# EAGLE design Tempy (EAGLE 7.7.0)
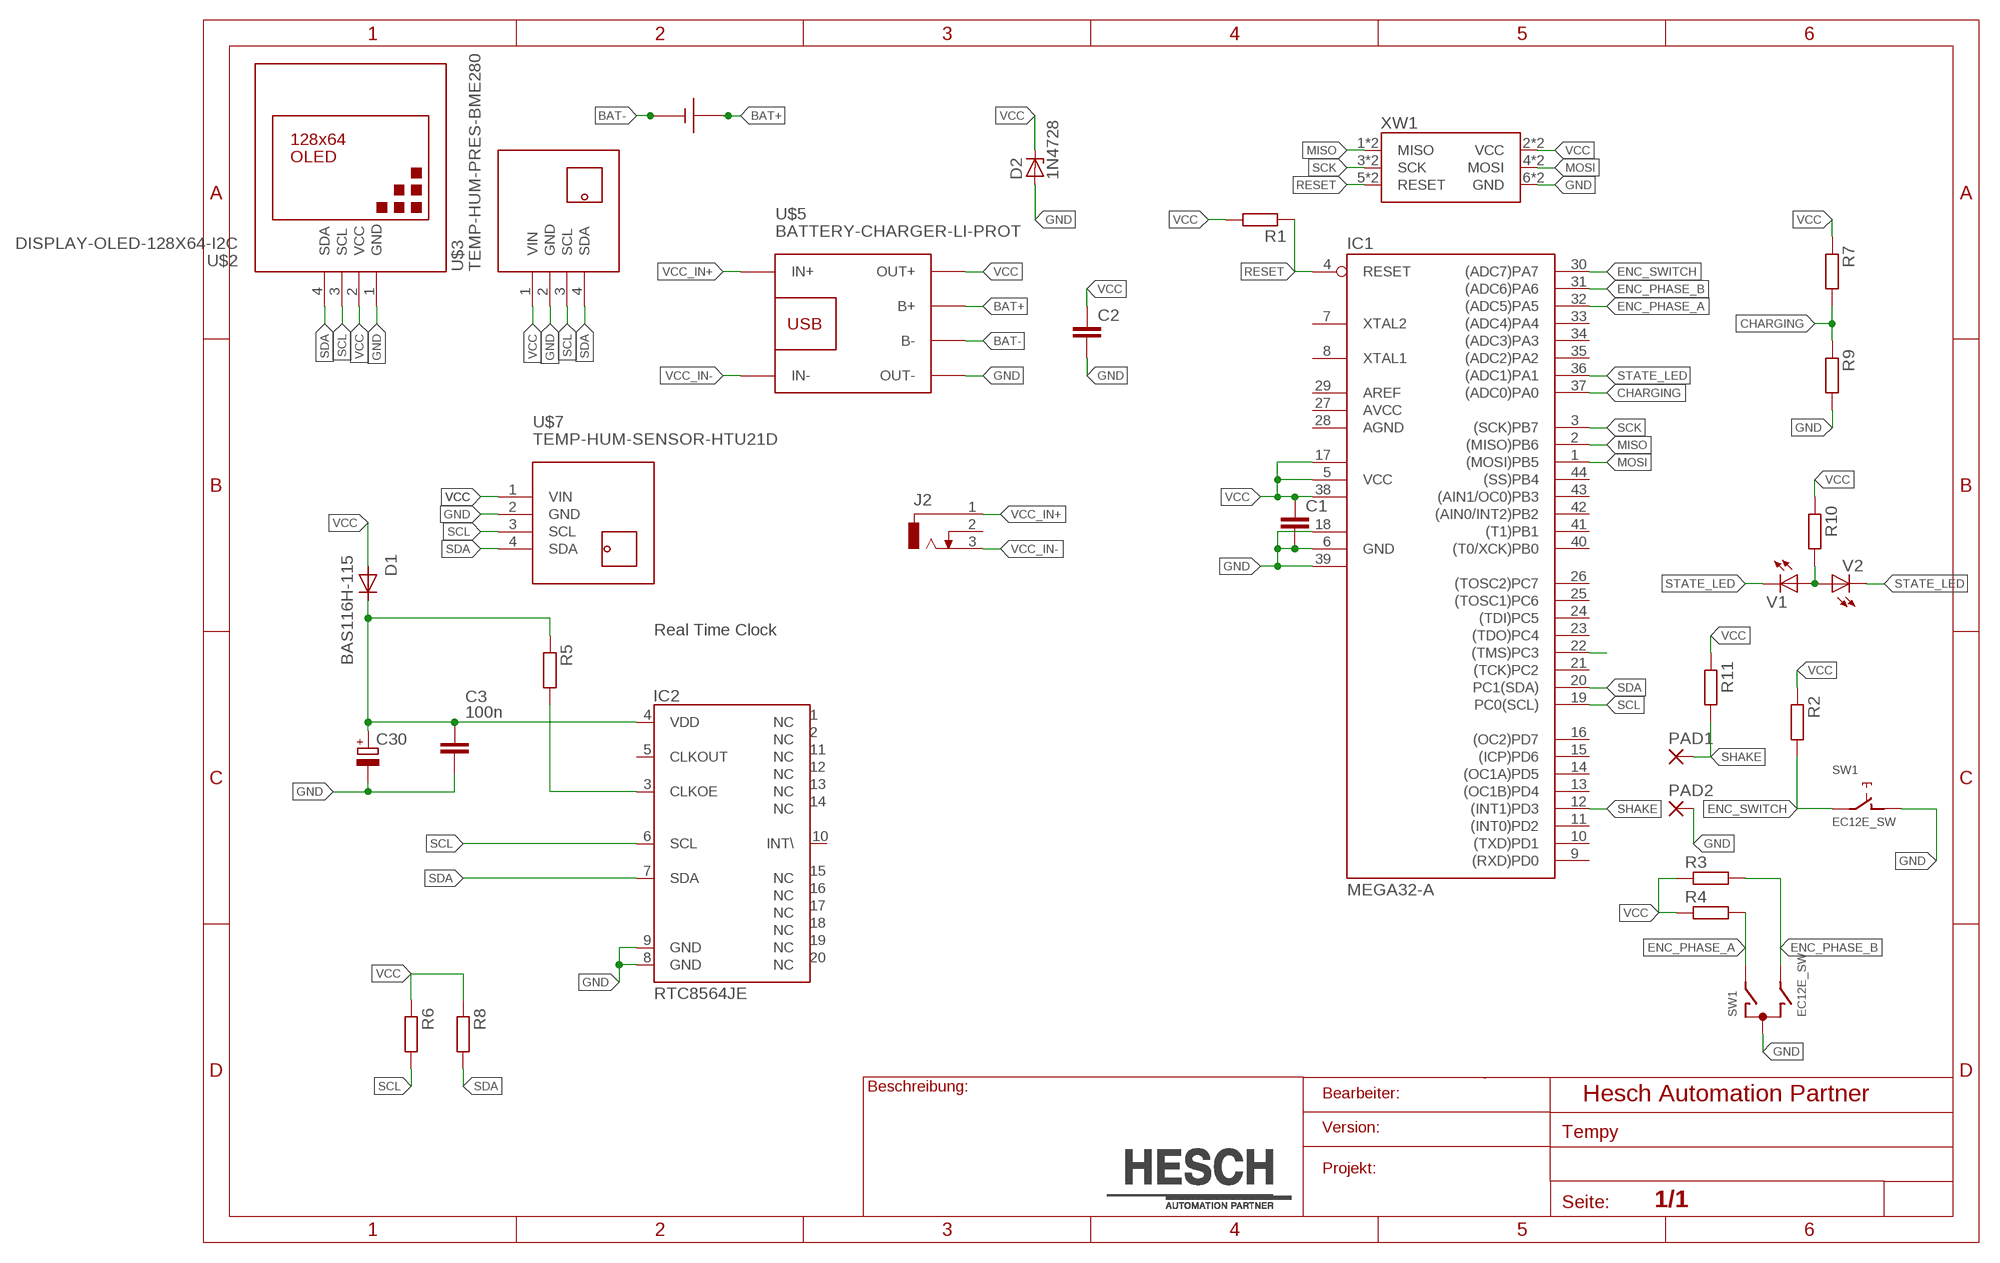
[diagram p0: schematic, sheet 1]

## Parts
C1  C-EUC0805K  [C0805K]
C2  C-EUC0805K  [C0805K]
C3  100n  C-EUC0805  [C0805]
C30  PANASONIC-EN&SD-SERIESTHT_1  [PANASONIC_SD_SERIES_STEHEND]
D1  BAS116H-115  [SOD123]
D2  1N4728  [DO41Z10]
IC1  MEGA32-A  [TQFP44]
IC2  RTC8564JESMD  [VSOJ20]
J2  DCJ0303  [DCJ0303]
PAD1  2,15/1,0  [2,15/1,0]
PAD2  2,15/1,0  [2,15/1,0]
R1  R-EU_R1206  [R1206]
R2  R-EU_R1206  [R1206]
R3  R-EU_R1206  [R1206]
R4  R-EU_R1206  [R1206]
R5  R-EU_R1206  [R1206]
R6  R-EU_R1206  [R1206]
R7  R-EU_R1206  [R1206]
R8  R-EU_R1206  [R1206]
R9  R-EU_R1206  [R1206]
R10  R-EU_R1206  [R1206]
R11  R-EU_R1206  [R1206]
SW1  EC12E_SW  [ALPS_EC12E_SW]
U$2  DISPLAY-OLED-128X64-I2C  [DISPLAY-OLED-128X64-I2C]
U$3  TEMP-HUM-PRES-BME280  [TEMP-HUM-PRES-BME280]
U$5  BATTERY-CHARGER-LI-PROT  [BATTERY-CHARGER-LI-PROT]
U$7  TEMP-HUM-SENSOR-HTU21D  [TEMP-HUM-SENSOR-HTU21D]
U$8  18650PTH  [18650-CASE-PTH]
V1  0805SMD  [0805]
V2  1206SMD  [1206]
XW1  WSL  [WSL_KOMBI]

## Nets
BAT+: U$5.B+ U$8.POS
BAT-: U$5.B- U$8.NEG
CHARGING: IC1.37((ADC0)PA0) R7.2 R9.1
ENC_PHASE_A: IC1.32((ADC5)PA5) R4.2 SW1.A
ENC_PHASE_B: IC1.31((ADC6)PA6) R3.2 SW1.B
ENC_SWITCH: IC1.30((ADC7)PA7) R2.2 SW1.E
GND: C1.2 C2.2 C3.2 C30.- D2.A IC1.6(GND) IC1.18(GND1) IC1.39(GND2) IC2.8(GND) IC2.9(GND) PAD2.1(P) R9.2 SW1.C SW1.D U$2.1(GND) U$3.2(GND) U$5.OUT- U$7.2(GND) XW1.6(GND) XW1.6.1(GND)
MISO: IC1.2((MISO)PB6) XW1.1(MISO) XW1.1.1(MISO)
MOSI: IC1.1((MOSI)PB5) XW1.4(MOSI) XW1.4.1(MOSI)
N$4: IC1.22((TMS)PC3)
N$6: R10.2 V1.A V2.A
N$12: IC2.3(CLKOE) R5.2
RESET: IC1.4(RESET) R1.1 XW1.5(RESET) XW1.5.1(RESET)
SCK: IC1.3((SCK)PB7) XW1.3(SCK) XW1.3.1(SCK)
SCL: IC1.19(PC0(SCL)) IC2.6(SCL) R6.2 U$2.3(SCL) U$3.3(SCL) U$7.3(SCL)
SDA: IC1.20(PC1(SDA)) IC2.7(SDA) R8.2 U$2.4(SDA) U$3.4(SDA) U$7.4(SDA)
SHAKE: IC1.12((INT1)PD3) PAD1.1(P) R11.2
STATE_LED: IC1.36((ADC1)PA1) V1.K V2.K
SUPPLY_RTC: C3.1 C30.+ D1.C IC2.4(VDD) R5.1
VCC: C1.1 C2.1 D1.A D2.C IC1.5(VCC) IC1.17(VCC1) IC1.38(VCC2) R1.2 R2.1 R3.1 R4.1 R6.1 R7.1 R8.1 R10.1 R11.1 U$2.2(VCC) U$3.1(VIN) U$5.OUT+ U$7.1(VIN) XW1.2(VCC) XW1.2.1(VCC)
VCC_IN+: J2.1 U$5.IN+
VCC_IN-: J2.3 U$5.IN-
Unconnected: IC1.7(XTAL2) IC1.8(XTAL1) IC1.9((RXD)PD0) IC1.10((TXD)PD1) IC1.11((INT0)PD2) IC1.13((OC1B)PD4) IC1.14((OC1A)PD5) IC1.15((ICP)PD6) IC1.16((OC2)PD7) IC1.21((TCK)PC2) IC1.23((TDO)PC4) IC1.24((TDI)PC5) IC1.25((TOSC1)PC6) IC1.26((TOSC2)PC7) IC1.33((ADC4)PA4) IC1.34((ADC3)PA3) IC1.35((ADC2)PA2) IC1.40((T0/XCK)PB0) IC1.41((T1)PB1) IC1.42((AIN0/INT2)PB2) IC1.43((AIN1/OC0)PB3) IC1.44((SS)PB4) IC2.1(NC) IC2.2(NC) IC2.5(CLKOUT) IC2.10(INT\) IC2.11(NC) IC2.12(NC) IC2.13(NC) IC2.14(NC) IC2.15(NC) IC2.16(NC) IC2.17(NC) IC2.18(NC) IC2.19(NC) IC2.20(NC) J2.2 SW1.GND1(G) SW1.GND2(G)

## Notes on the sheet
- Real Time Clock

## Power pins joined to a net without a drawn wire
AGND: IC1.28(AGND)
AREF: IC1.29(AREF)
AVCC: IC1.27(AVCC)

## Library data of the parts
C1-C3 = rcl:C-EU: CAPACITOR, European symbol
C30 = Kondensator - GoldCaps:PANASONIC-EN&SD-SERIES: Name des Bauteiles: -->Doppelschicht Kondensator Daten:radial (stehend), 70°C, 5,5V Artikelnummer:#014000 Datenblatt:www.alldatasheet.com __________________________________________ generated by Eagle Description Tool am : 23.01.2014 13:04:36 erstellt von: Hm
D1 = Dioden:BAS116H: Name des Bauteiles: -->BAS116H Daten:BAS116H Ultra Low Leakage Diode speziell für die energiesparende Verbindung von Goldcaps mit Echtzeituhren, extrem kleiner Leckstrom Artikelnummer:#105016 Datenblatt:www.alldatasheet.com __________________________________________ generated by Eagle Description Tool am : 29.01.2014 07:16:55 erstellt von: Hm
D2 = diode:1N4728: Z DIODE 3.3 V, 1W, 5 percent
IC1 = Atmel - µController:MEGA32: MICROCONTROLLER 32 Kbytes FLASH 2 Kbytes SRAM 1 Kbytes EEPROM USART 8-channel 10 bit ADC
IC2 = Echtzeituhr - RTC8564JE:RTC8564JE: Name des Bauteiles: -->RTC8564JE Daten:Bauform : VSO120 Artikelnummer:#045172 Datenblatt:www.alldatasheet.com __________________________________________ generated by Eagle Description Tool am : 23.01.2014 10:55:17 erstellt von: Hm
J2 = con-jack:DCJ0303: DC POWER JACK Source: DCJ0303.pdf; OC_FARNELL: unknown; OC_NEWARK: unknown
PAD1 PAD2 = wirepad:2,15/1,0: THROUGH-HOLE PAD
R1-R11 = rcl:R-EU_: RESISTOR, European symbol
SW1 = switch-alps:EC12E_SW: ALPS rotary Encoder EC12E series with switch; MPN: EC12E2424407; OC_FARNELL: 1520813; OC_NEWARK: 74M1068
U$2 = diy-modules:DISPLAY-OLED-128X64-I2C: 128x64 Dot Matrix OLED Module based on SSD1306 chip Variant with I2C interface More details available here: http://www.instructables.com/id/Monochrome-096-i2c-OLED-display-with-arduino-SSD13/ SSD1306 datasheet: https://cdn-shop.adafruit.com/datasheets/SSD1306.pdf Click here to find device on ebay.com <http://www.ebay.com/sch/oled+display+128x64+iic> Note: There are two variants: I2C and SPI. Search for the proper version.
U$3 = diy-modules:TEMP-HUM-PRES-BME280: Digital Humidity-Temperature-Pressure Sensor based on BME280 device More information about BME280 device is available here: https://www.bosch-sensortec.com/bst/products/all_products/bme280 Click here to find device on ebay.com <http://www.ebay.com/sch/bme280+breakout>
U$5 = diy-modules:BATTERY-CHARGER-LI-PROT: Lithium Battery 5V Charger with protection circuit More details available here: http://www.instructables.com/id/DIY-Lithium-ion-Battery-Charger/step4/TP4056-based-lithium-ion-battery-charger-module/ Click here to find device on ebay.com <http://www.ebay.com/sch/tp4056+charger+usb+protection>
U$7 = diy-modules:TEMP-HUM-SENSOR-HTU21D: Digital Humidity & Temperature Sensor based on HTU21D device More information about HTU21D device is available here: http://futureeverything.org/wp-content/uploads/2014/05/Humidity-Datasheet.pdf HTU21D Arudino Library is available here: https://learn.sparkfun.com/tutorials/htu21d-humidity-sensor-hookup-guide/htu21d-library-and-functions Click here to find device on ebay.com <http://www.ebay.com/sch/htu21d+board>
U$8 = Batteriehalter - 18650:18650: Lithium Ion 18650
V1 = LED´s:0805
V2 = LED´s:1206
XW1 = Atmel - ISP_6   (AVR ISP MKII):WSL: Name des Bauteiles: Wannenstecker 6 pol. Daten: 6 pol. goldene Kontakte ! Artikelnummer:#131231 Datenblatt:www.datasheet.com / www.reichelt.de

## Board
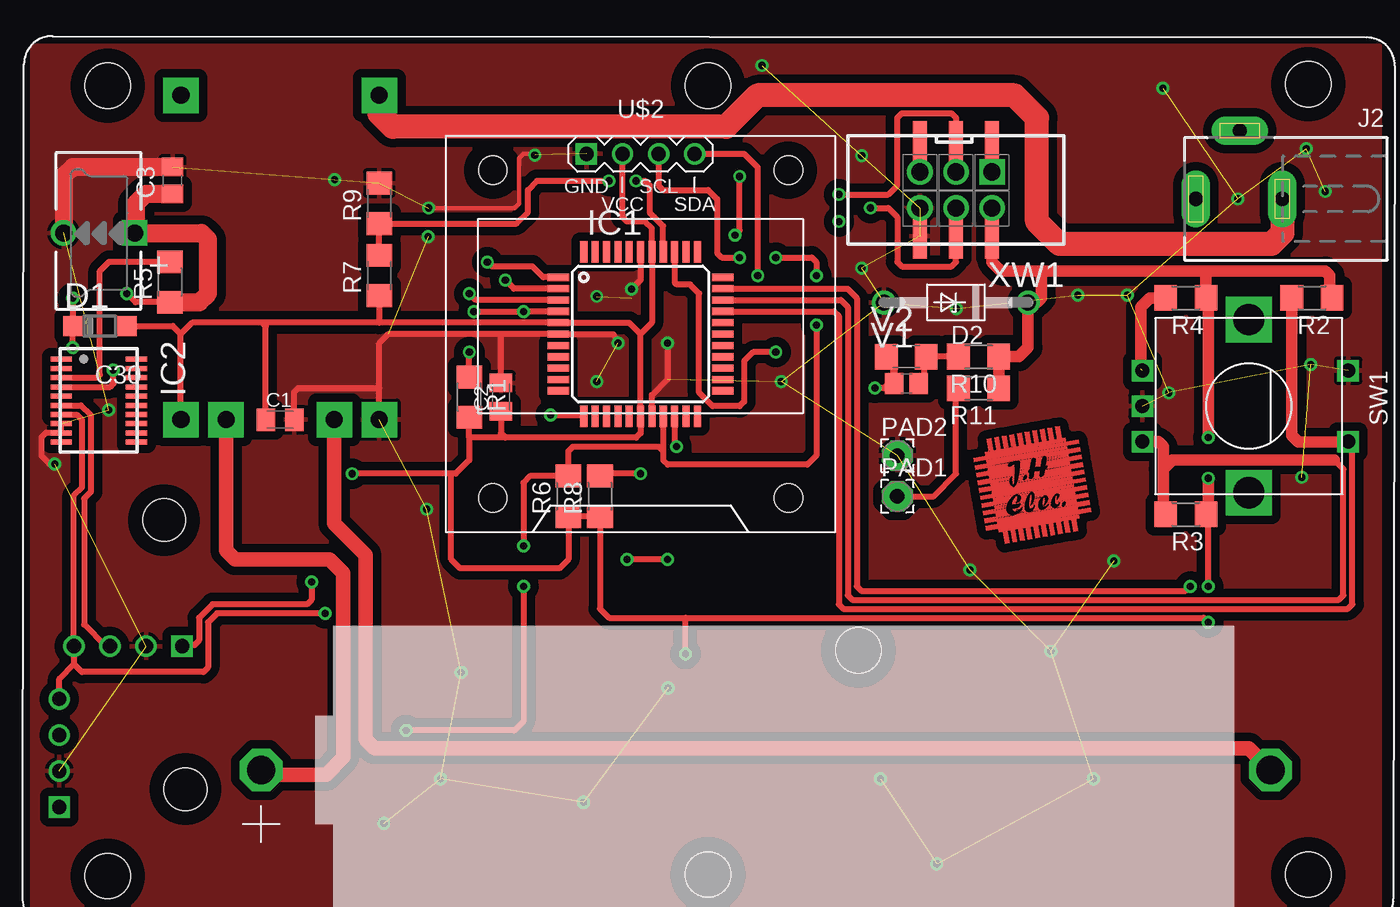
[diagram p1: board, top side]
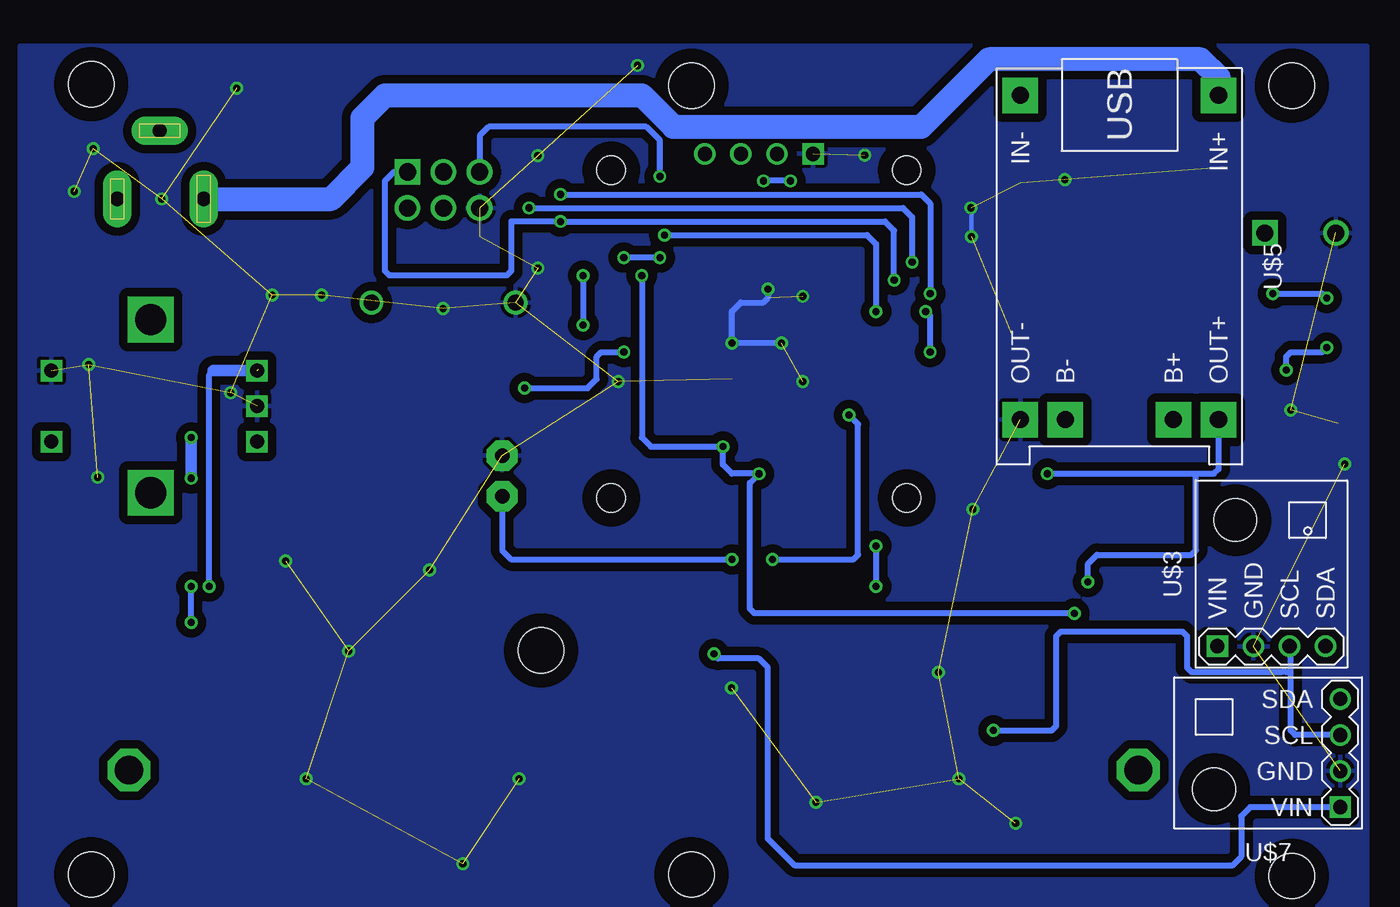
[diagram p2: board, bottom side, seen from below]

No outline drawn. Coordinates in mm, seen from the top.
Copper layers (1*16): Top 0.035mm / dielectric 1.5mm / Bottom 0.035mm
Design rules "default": minimum track width 10mil, minimum drill 24mil, track to track 8mil, track to pad 8mil, pad to pad 8mil, via to via 8mil, smd to smd 8mil, copper to edge 40mil, drill to drill 8mil, minimum pad ring 10mil, minimum via ring 8mil, stop-mask expansion 4mil, vias tented up to drill 0mil, thermal gap 10mil

### Footprints (pad centres in the part's own frame; a part is rotated, then mirrored left to right if it is on the bottom)
C0805K = smd 1.3 x 1.6: 1 -1,0; 2 1,0
C0805 = smd 1.3 x 1.5: 1 -0.95,0; 2 0.95,0
PANASONIC_SD_SERIES_STEHEND = drill 1.2 square: + -2.54,-6.35 | drill 1.2: - 2.46,-6.35
SOD123 = smd 1.4 x 1.4: A 1.9,0; C -1.9,0
DO41Z10 = drill 1.118: A 5.08,0; C -5.08,0
TQFP44 = smd 1.5 x 0.5: 1 -5.8,4; 2 -5.8,3.2; 3 -5.8,2.4; 4 -5.8,1.6; 5 -5.8,0.8; 6 -5.8,0; 7 -5.8,-0.8; 8 -5.8,-1.6; 9 -5.8,-2.4; 10 -5.8,-3.2; 11 -5.8,-4; 23 5.8,-4; 24 5.8,-3.2; 25 5.8,-2.4; 26 5.8,-1.6; 27 5.8,-0.8; 28 5.8,0; 29 5.8,0.8; 30 5.8,1.6; 31 5.8,2.4; 32 5.8,3.2; 33 5.8,4 | smd 0.5 x 1.5: 12 -4,-5.8; 13 -3.2,-5.8; 14 -2.4,-5.8; 15 -1.6,-5.8; 16 -0.8,-5.8; 17 0,-5.8; 18 0.8,-5.8; 19 1.6,-5.8; 20 2.4,-5.8; 21 3.2,-5.8; 22 4,-5.8; 34 4,5.8; 35 3.2,5.8; 36 2.4,5.8; 37 1.6,5.8; 38 0.8,5.8; 39 0,5.8; 40 -0.8,5.8; 41 -1.6,5.8; 42 -2.4,5.8; 43 -3.2,5.8; 44 -4,5.8
VSOJ20 = smd 0.35 x 1.5: 1 0,0; 2 0.65,0; 3 1.3,0; 4 1.95,0; 5 2.6,0; 6 3.25,0; 7 3.9,0; 8 4.55,0; 9 5.2,0; 10 5.85,0; 11 5.85,5.3; 12 5.2,5.3; 13 4.55,5.3; 14 3.9,5.3; 15 3.25,5.3; 16 2.6,5.3; 17 1.95,5.3; 18 1.3,5.3; 19 0.65,5.3; 20 0,5.3
DCJ0303 = drill 1 pad 2 long: 1 0,3.1; 2 4.8,0; 3 0,-3
2,15/1,0 = drill 1.016 pad 2.159 octagon: 1 0,0
R1206 = smd 1.6 x 1.803: 1 -1.422,0; 2 1.422,0
ALPS_EC12E_SW = drill 1 square: A -2.5,-7.5; B 2.5,-7.5; C 0,-7.5; D -2.5,7; E 2.5,7 | drill 2.2 square: GND1 -6.1,0; GND2 6.1,0
DISPLAY-OLED-128X64-I2C = drill 1 square: 1 -3.81,12.7 | drill 1: 2 -1.27,12.7; 3 1.27,12.7; 4 3.81,12.7 | hole 2: -10.414,11.557; 10.414,11.557; 10.414,-11.557; -10.414,-11.557
TEMP-HUM-PRES-BME280 = drill 1 square: 1 -5.08,3.81 | drill 1: 2 -5.08,1.27; 3 -5.08,-1.27; 4 -5.08,-3.81 | hole 3: 3.81,2.54
DONAU_KGB10 = hole 3.2: 0,0; 42.3,0; -42.3,-0.1; -42.3,55.6; 0,55.6; 42.3,55.7; 10.6,15.8
BATTERY-CHARGER-LI-PROT = drill 1.2 pad 2.5 square: B+ 10.795,3.81; B- 10.795,-3.81; IN+ -12.065,6.985; IN- -12.065,-6.985; OUT+ 10.795,6.985; OUT- 10.795,-6.985
TEMP-HUM-SENSOR-HTU21D = drill 1 square: 1 -5.08,3.81 | drill 1: 2 -5.08,1.27; 3 -5.08,-1.27; 4 -5.08,-3.81 | hole 3: 3.81,2.54
18650-CASE-PTH = drill 2 octagon: NEG -35.56,0; POS 35.56,0
0805 = smd 1.3 x 1.5: A 0.85,0; K -0.85,0
1206 = smd 1.6 x 1.8: A 1.4,0; K -1.4,0
WSL_KOMBI = drill 1.2 square: 1 -2.54,-1.27 | smd 1 x 3.2: 1.1 -2.54,-3.24; 2.1 -2.54,3.24; 3.1 0,-3.24; 4.1 0,3.24; 5.1 2.54,-3.24; 6.1 2.54,3.24 | drill 1.2: 2 -2.54,1.27; 3 0,-1.27; 4 0,1.27; 5 2.54,-1.27; 6 2.54,1.27

### Placement (x,y rotation side)
C1  19.68,67.31 0 top
C2  35.24,68.9 90 top
C3  12.11,84.17 90 top
C30  6.89,74.12 180 top
D1  7,73.91 0 top
D2  67.31,75.56 180 top
IC1  45.09,73.34 0 top
IC2  4.26,71.57 270 top
J2  87.31,82.87 90 top
PAD1  63.18,61.91 0 top
PAD2  63.18,64.77 0 top
R1  33.02,68.9 270 top
R2  92.39,75.88 180 top
R3  83.5,60.64 180 top
R4  83.5,75.88 180 top
R5  11.93,77.01 90 top
R6  40.01,61.91 90 top
R7  26.67,77.47 90 top
R8  42.23,61.91 90 top
R9  26.67,82.55 90 top
R10  68.9,71.75 180 top
R11  68.9,69.53 180 top
SW1  87.95,68.26 270 top
U$2  45.09,73.34 0 top
U$3  8.97,56.42 90 bottom
U$4  [DONAU_KGB10]  49.84,35.25 0 top
U$5  19.68,78.11 270 bottom
U$6  [25X25_BEST]  20.16,79.6 10 top
U$7  9.21,43.81 180 bottom
U$8  53.91,42.61 180 top
U$9  [25X25]  72.71,62.55 10 top
V1  63.82,69.85 0 top
V2  63.82,71.75 0 top
XW1  67.31,83.5 180 top

### Tracks (layer width: path | path; a pad name or v marks a point on that pad's centre or on a via)
BAT+
  Top 1.016: U$5.B+ 15.88,58.1 16.51,57.47 23.18,57.47 24.13,56.52 24.13,43.5 22.93,42.3 18.35,42.3 U$8.POS
BAT-
  Top 1.016: U$5.B- 23.5,60.01 25.72,57.78 25.72,44.77 26.35,44.13 87.95,44.13 U$8.NEG
CHARGING  (via drill 0.5)
  Top 0.406: R7.2 R9.1 36.36,81.13 37.15,81.92 37.15,83.5 37.78,84.14 v42.86,84.14 | IC1.37 46.69,80.96 46.05,81.6 46.04,81.6 45.72,81.92 45.72,83.82 45.4,84.14 v44.77,84.14
  Bottom 0.406: v42.86,84.14 v44.77,84.14
ENC_PHASE_A  (via drill 0.5)  (1 unrouted)
  Top 0.406: IC1.32 59.66,76.54 60.33,75.88 60.33,55.56 60.64,55.24 83.5,55.24 v83.82,55.56
  Top 0.813: 80.33,70.88 80.33,75.25 80.96,75.88 R4.2
  Bottom 0.406: v83.82,55.56 83.82,70.48 83.54,70.76
  Bottom 0.813: SW1.A 83.54,70.76
ENC_PHASE_B
  Top 0.406: IC1.31 59.2,75.74 59.69,75.25 59.69,54.93 60.01,54.61 94.3,54.61 94.61,54.93 94.61,63.82 93.98,64.45 | 81.92,60.81 R3.2
  Top 0.813: SW1.B 81.56,65.76 81.92,65.41 81.92,63.82 | 81.92,63.82 81.92,60.81 | 93.98,64.45 82.55,64.45 81.92,63.82
ENC_SWITCH
  Top 0.406: IC1.30 58.73,74.94 59.05,74.61 59.05,54.29 59.37,53.98 94.93,53.98 95.25,54.29 95.25,65.46 | 94.91,65.72 SW1.E
  Top 0.813: R2.2 90.97,66.19 91.44,65.72 94.91,65.72 | 95.25,65.46 SW1.E
GND  (via drill 0.5)  (43 unrouted)
  Top 0.305: v30.16,82.23 36.2,82.23 36.51,82.55 36.51,85.72 36.83,86.04 37.55,86.04 v37.63,85.95
  Top 0.406: U$5.OUT- 26.67,69.53 | 26.67,69.53 26.67,72.71 27.3,73.34 35.24,73.34 | 35.24,73.34 IC1.6 43.18,73.34 v43.5,72.71 | IC1.39 45.09,77.15 v44.45,76.52 | v46.99,72.71 46.99,70.17 45.88,69.06 IC1.18 | C1.2 20.68,69.26 20.95,69.53 26.67,69.53 | C2.2 35.24,73.34 | IC2.8 IC2.9 3.19,66.37 2.86,66.04 2.86,64.77 3.45,64.17 v3.81,64.17
  Top 1.27: C3.2 5.11,85.11 4.45,84.45 4.45,80.48 C30.-
  Bottom 0.305: v30.11,80.2 30.11,81.86 v30.16,82.23
  Bottom 0.406: v44.45,76.52 44.45,75.88 44.77,75.56 46.35,75.56 46.99,74.93 v46.99,72.71 v43.5,72.71
  other vias: 47.03,48.4 41.06,40.35 74,51 77,42 62,42 65.95,36.01 91.99,86.4 93.32,83.4 81.89,90.67 87.17,82.87 53.65,92.27 23.52,84.24 91.67,63.25 82.31,69.2 92.31,71.2 7.62,67.98 30,61 32.43,49.51 27,38.86 31,42 55,70 42,76 42,70 68.28,56.72 67.33,75.13 60.66,77.99 75.91,76.08 79.4,76.08 78.44,57.35 60.66,85.92
  pour Top (isolate 0.61): 95.89,32.07 2.22,32.07 2.22,93.66 97.16,93.66 97.16,32.07
  pour Bottom (isolate 0.61): 97.16,32.07 2.22,32.07 2.22,93.66 97.16,93.66
MISO  (via drill 0.5)
  Top 0.406: IC1.2 36.17,76.54 v35.56,77.15 | XW1.1 XW1.1.1
  Bottom 0.406: v35.56,77.15 35.56,80.64 36.2,81.28 v59.05,81.28 62.55,81.28 62.55,77.79 62.87,77.47 71.12,77.47 71.44,77.79 71.44,84.14 70.8,84.77 XW1.1
MOSI  (via drill 0.5)
  Top 0.406: IC1.1 38.23,77.34 37.47,78.11 34.61,78.11 v34.29,78.42 | v61.28,82.23 62.55,82.23 63.18,81.6 63.18,78.42 63.5,78.11 66.99,78.11 67.31,78.42 XW1.4.1 XW1.4
  Bottom 0.406: v61.28,82.23 34.92,82.23 34.29,81.6 v34.29,78.42
N$6
  Top 0.406: R10.2 V2.A 65.09,71.62 65.09,70.48 64.67,70.06 V1.A
N$12
  Top 0.406: IC2.3 6.77,70.27 6.99,70.48 6.99,77.79 7.63,78.43 R5.2
RESET  (via drill 0.5)
  Top 0.406: IC1.4 36.84,74.94 v36.83,74.93 v33.34,74.93 | R1.1 v33.02,72.07 | v51.75,80.33 52.07,80.64 v52.07,84.45 | XW1.5.1 XW1.5
  Bottom 0.406: v51.75,80.33 37.47,80.33 36.83,79.69 v36.83,74.93 | v33.02,72.07 33.02,74.61 v33.34,74.93 | v52.07,84.45 52.07,87 53.02,87.95 64.14,87.95 64.77,87.31 XW1.5
SCK  (via drill 0.5)
  Top 0.406: IC1.3 33.48,75.74 v33.02,76.2 | v59.05,83.19 62.55,83.19 63.18,83.82 63.18,88.58 63.5,88.9 66.99,88.9 67.31,88.58 XW1.3.1 XW1.3
  Bottom 0.406: v59.05,83.19 33.66,83.19 33.02,82.55 v33.02,76.2
SCL  (via drill 0.5)
  Top 0.406: v57.47,73.98 57.47,64.77 56.83,64.14 46.99,64.14 46.69,64.44 46.69,65.09 | IC1.19 46.69,65.09 | 46.69,65.09 46.37,65.41 40.32,65.41 40.01,65.09 R6.2 37.3,63.33 36.83,62.87 v36.83,58.42 | U$3.3 7.39,51.34 5.87,52.86 5.87,61.75 6.35,62.23 6.35,67.63 5.66,68.32 IC2.6 | v36.83,55.56 36.83,46.04 36.2,45.4 v28.57,45.4 | U$2.3 46.35,83.82 46.67,83.5 49.85,83.5 50.48,82.87 50.48,79.06 50.8,78.74 v52.07,78.74 | v54.61,78.74 57.15,78.74 57.47,78.42 v57.47,77.47
  Bottom 0.406: v57.47,77.47 v57.47,73.98 | v36.83,58.42 v36.83,55.56 | v28.57,45.4 24.45,45.4 24.13,45.72 24.13,52.07 23.81,52.39 15.24,52.39 14.92,52.07 14.92,49.85 14.61,49.53 8.26,49.53 7.94,49.53 7.62,49.53 | v52.07,78.74 v54.61,78.74 | 7.62,49.53 7.62,45.4 7.3,45.09 U$7.3 | 7.62,49.53 7.62,51.27 U$3.3
SDA  (via drill 0.5)
  Top 0.406: v45.09,63.5 42.39,63.5 R8.2 | IC1.20 47.48,65.55 v47.62,65.41 | U$2.4 52.39,86.04 53.34,85.09 v53.34,77.47 | v22.86,53.66 15.24,53.66 14.61,53.02 14.61,49.85 14.29,49.53 5.71,49.53 5.16,50.09 | 5.16,50.09 U$3.4 5.16,61.99 5.71,62.55 5.71,67.31 5.35,67.67 IC2.7 | U$7.4 4.13,49.05 5.16,50.09
  Bottom 0.406: v53.34,77.47 53.34,66.04 52.7,65.41 v47.62,65.41 47.62,64.14 46.99,63.5 v45.09,63.5 45.72,62.87 45.72,53.98 45.4,53.66 v22.86,53.66
SHAKE  (via drill 0.5)
  Top 0.406: PAD1.1 65.72,61.91 67.31,63.5 67.31,69.37 R11.2 | v46.99,57.47 v44.13,57.47 | v38.73,67.63 41,67.63 IC1.12
  Bottom 0.406: PAD1.1 63.18,58.1 62.55,57.47 v46.99,57.47 | v44.13,57.47 38.42,57.47 38.1,57.78 38.1,66.99 v38.73,67.63
STATE_LED  (via drill 0.5)
  Top 0.406: 62.87,71.12 62.97,71.02 V1.K 62.97,71.2 V2.K 62.42,71.57 62.87,71.12 | 62.87,71.12 62.87,70.17 62.23,69.53 v61.59,69.53 | v54.61,72.07 53.02,72.07 52.39,71.44 52.39,68.58 52.07,68.26 50.16,68.26 49.21,69.22 49.21,76.2 48.58,76.83 47.62,76.83 47.48,76.97 IC1.36
  Bottom 0.406: v61.59,69.53 57.15,69.53 56.52,70.17 56.52,71.75 56.2,72.07 v54.61,72.07
SUPPLY_RTC  (via drill 0.5)
  Top 0.254: D1.C 5.15,73.91
  Top 0.406: IC2.4 7.71,69.62 7.94,69.85 v7.94,70.8 | v5.08,72.39 5.08,73.89 D1.C 5.08,73.93 v5.08,75.88 | R5.1 9.51,75.58 v8.89,76.2
  Top 1.27: R5.1 13.99,75.58 14.61,76.2 14.61,80.01 14.14,80.47 C30.+ 9.53,80.56 9.53,82.55 10.19,83.22 C3.1
  Bottom 0.406: v7.94,70.8 7.94,71.75 7.62,72.07 5.4,72.07 v5.08,72.39 | v8.89,76.2 5.4,76.2 v5.08,75.88
VCC  (via drill 0.5)
  Top 0.406: U$2.2 43.81,81.6 44.13,81.28 45.4,81.28 45.88,80.8 IC1.38 45.88,74.14 45.09,73.34 | U$5.OUT+ 12.7,73.34 | 12.7,73.34 13.5,74.14 18.41,74.14 | 26.67,74.14 IC1.5 44.28,74.14 45.09,73.34 | 26.67,74.14 18.41,74.14 | 45.09,73.34 IC1.17 45.09,66.36 44.77,66.04 35.56,66.04 | C1.1 18.68,73.87 18.41,74.14 | 33.02,66.04 33.02,64.45 32.07,63.5 31.75,63.5 | 31.75,63.5 v24.77,63.5 | 48.26,53.34 42.86,53.34 42.23,53.98 R8.1 R6.1 40.01,57.47 39.37,56.83 32.38,56.83 31.75,57.47 31.75,63.5 | 48.26,53.34 84.77,53.34 v85.09,53.02 | 35.56,66.04 33.02,66.04 | 33.02,66.04 R1.2 | C2.1 35.24,66.36 35.56,66.04 | v85.09,55.56 85.09,60.48 R3.1 85.09,60.81 | D1.A 12.13,73.91 12.7,73.34 | v21.91,55.88 21.91,54.61 21.59,54.29 14.92,54.29 13.97,53.34 13.97,51.75 13.65,51.44 12.87,51.44 U$3.1 | 85.09,75.72 R4.1 | v48.26,50.8 48.26,53.34 | 84.92,77.31 85.41,77.79 | 93.66,76.03 R2.1 | XW1.2.1 XW1.2 | R7.1 26.67,74.14
  Top 0.813: 85.09,75.72 v85.09,66.04 | v85.09,63.18 85.09,60.81 | R4.1 84.92,77.31 | 93.66,76.03 93.66,77.47 93.34,77.79 85.41,77.79 73.34,77.79 | XW1.2.1 69.85,78.42 70.48,77.79 73.34,77.79 | 73.34,77.79 73.34,75.88 73.03,75.56 D2.C 72.39,72.39 71.75,71.75 R10.1 R11.1
  Bottom 0.406: v21.91,55.88 21.91,57.15 21.27,57.78 14.61,57.78 14.29,58.1 14.29,63.5 | v24.77,63.5 14.29,63.5 | v85.09,53.02 v85.09,55.56 | 14.29,63.5 13.02,63.5 12.7,63.82 U$5.OUT+ | v48.26,50.8 47.94,50.48 45.09,50.48 44.45,49.85 44.45,37.78 42.55,35.88 11.75,35.88 11.11,36.51 11.11,39.37 10.48,40.01 U$7.1
  Bottom 0.813: v85.09,66.04 v85.09,63.18
VCC_IN+
  Bottom 1.676: J2.1 75.25,82.87 73.03,85.09 73.03,88.58 71.44,90.17 53.34,90.17 51.12,87.95 33.66,87.95 28.89,92.71 13.97,92.71 12.7,91.44 U$5.IN+
VCC_IN-
  Top 1.676: U$5.IN- 26.67,88.9 27.62,87.95 51.12,87.95 53.34,90.17 71.44,90.17 73.03,88.58 73.03,81.28 74.61,79.69 89.53,79.69 90.31,80.47 J2.3